# EAGLE schematic synchronization clock - physical connectionsch (EAGLE 6.5.0)
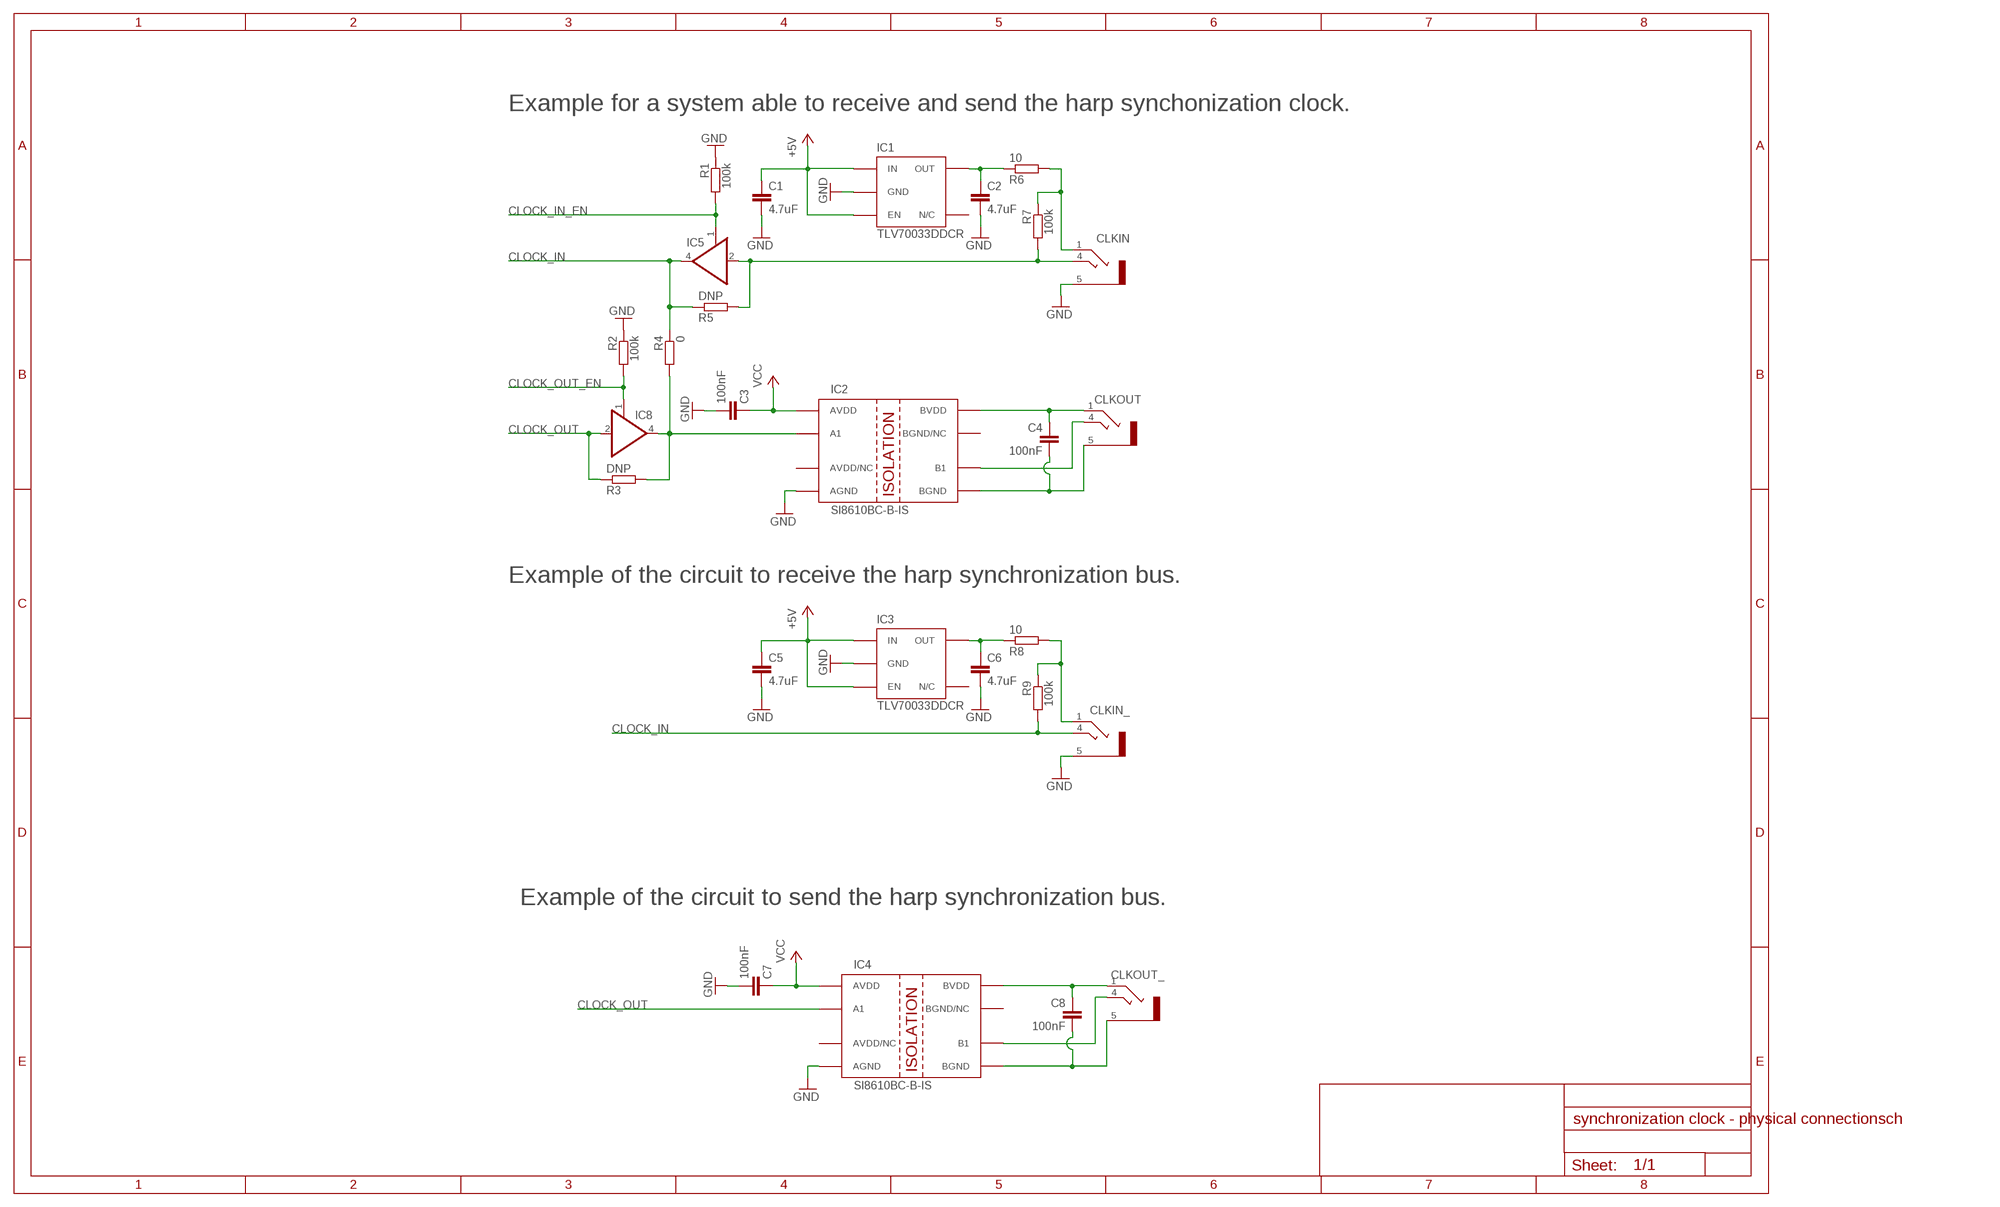
[diagram p0: schematic, sheet 1]

## Parts
C1  4.7uF  C-EUC0603  [C0603]
C2  4.7uF  C-EUC0603  [C0603]
C3  100nF  C-EUC0402  [C0402]
C4  100nF  C-EUC0402  [C0402]
C5  4.7uF  C-EUC0603  [C0603]
C6  4.7uF  C-EUC0603  [C0603]
C7  100nF  C-EUC0402  [C0402]
C8  100nF  C-EUC0402  [C0402]
CLKIN  STEREO_JACK  [35RASMT2BHNTRX]
CLKIN_  STEREO_JACK  [35RASMT2BHNTRX]
CLKOUT  STEREO_JACK  [35RASMT2BHNTRX]
CLKOUT_  STEREO_JACK  [35RASMT2BHNTRX]
IC1  TLV70033DDCR  TLV700XX  [TSOT23-5]
IC2  SI8610BC-B-IS  SI8610  [SO-08]
IC3  TLV70033DDCR  TLV700XX  [TSOT23-5]
IC4  SI8610BC-B-IS  SI8610  [SO-08]
IC5  74AHC1G126DCK  [SC70-5]
IC8  74AHC1G126DCK  [SC70-5]
R1  100k  R-EU_R0402  [R0402]
R2  100k  R-EU_R0402  [R0402]
R3  DNP  R-EU_R0402  [R0402]
R4  0  R-EU_R0402  [R0402]
R5  DNP  R-EU_R0402  [R0402]
R6  10  R-EU_R0402  [R0402]
R7  100k  R-EU_R0402  [R0402]
R8  10  R-EU_R0402  [R0402]
R9  100k  R-EU_R0402  [R0402]

## Nets
+5V: C1.1 C5.1 IC1.1(IN) IC1.3(EN) IC3.1(IN) IC3.3(EN)
CLOCK_IN: CLKIN_.4 IC5.4(O) R4.1 R5.1 R9.2
CLOCK_IN_EN: IC5.1(OE) R1.2
CLOCK_OUT: IC4.2(A1) IC8.2(I) R3.1
CLOCK_OUT_EN: IC8.1(OE) R2.2
GND: C1.2 C2.2 C3.2 C5.2 C6.2 C7.2 CLKIN.5 CLKIN_.5 IC1.2(GND) IC2.4(AGND) IC3.2(GND) IC4.4(AGND) R1.1 R2.1
GND_ISO: C4.2 CLKOUT.5 IC2.5(BGND)
GND_ISO1: C8.2 CLKOUT_.5 IC4.5(BGND)
N$1: C8.1 CLKOUT_.1 IC4.8(BVDD)
N$2: CLKOUT.4 IC2.6(B1)
N$3: CLKOUT_.4 IC4.6(B1)
N$4: CLKIN_.1 R8.2 R9.1
N$5: C4.1 CLKOUT.1 IC2.8(BVDD)
N$6: C6.1 IC3.5(OUT) R8.1
N$41: CLKIN.1 R6.2 R7.1
N$42: C2.1 IC1.5(OUT) R6.1
N$43: IC2.2(A1) IC8.4(O) R3.2 R4.2
SYNCIN: CLKIN.4 IC5.2(I) R5.2 R7.2
VCC: C3.1 C7.1 IC2.1(AVDD) IC4.1(AVDD)
Unconnected: IC1.4(N/C) IC2.3(AVDD/NC) IC2.7(BGND/NC) IC3.4(N/C) IC4.3(AVDD/NC) IC4.7(BGND/NC)

## Notes on the sheet
- Example for a system able to receive and send the harp synchonization clock.
- Example of the circuit to receive the harp synchronization bus.
- Example of the circuit to send the harp synchronization bus.

## Power pins joined to a net without a drawn wire
GND: IC5.3(GND) IC8.3(GND)
VCC: IC5.5(VCC) IC8.5(VCC)

## Library data of the parts
C1-C8 = rcl:C-EU: CAPACITOR, European symbol
CLKIN CLKIN_ CLKOUT CLKOUT_ = CNP-connectors:STEREO_JACK
IC1 IC3 = CNP:TLV700XX
IC2 IC4 = CNP-ics 2:SI8610
IC5 IC8 = 74xx-little-de:74*1G126: Single Bus Buffer Gate With 3-State Outputs
R1-R9 = rcl:R-EU_: RESISTOR, European symbol